# Altium project PCB_Trafficlight.PrjPCB
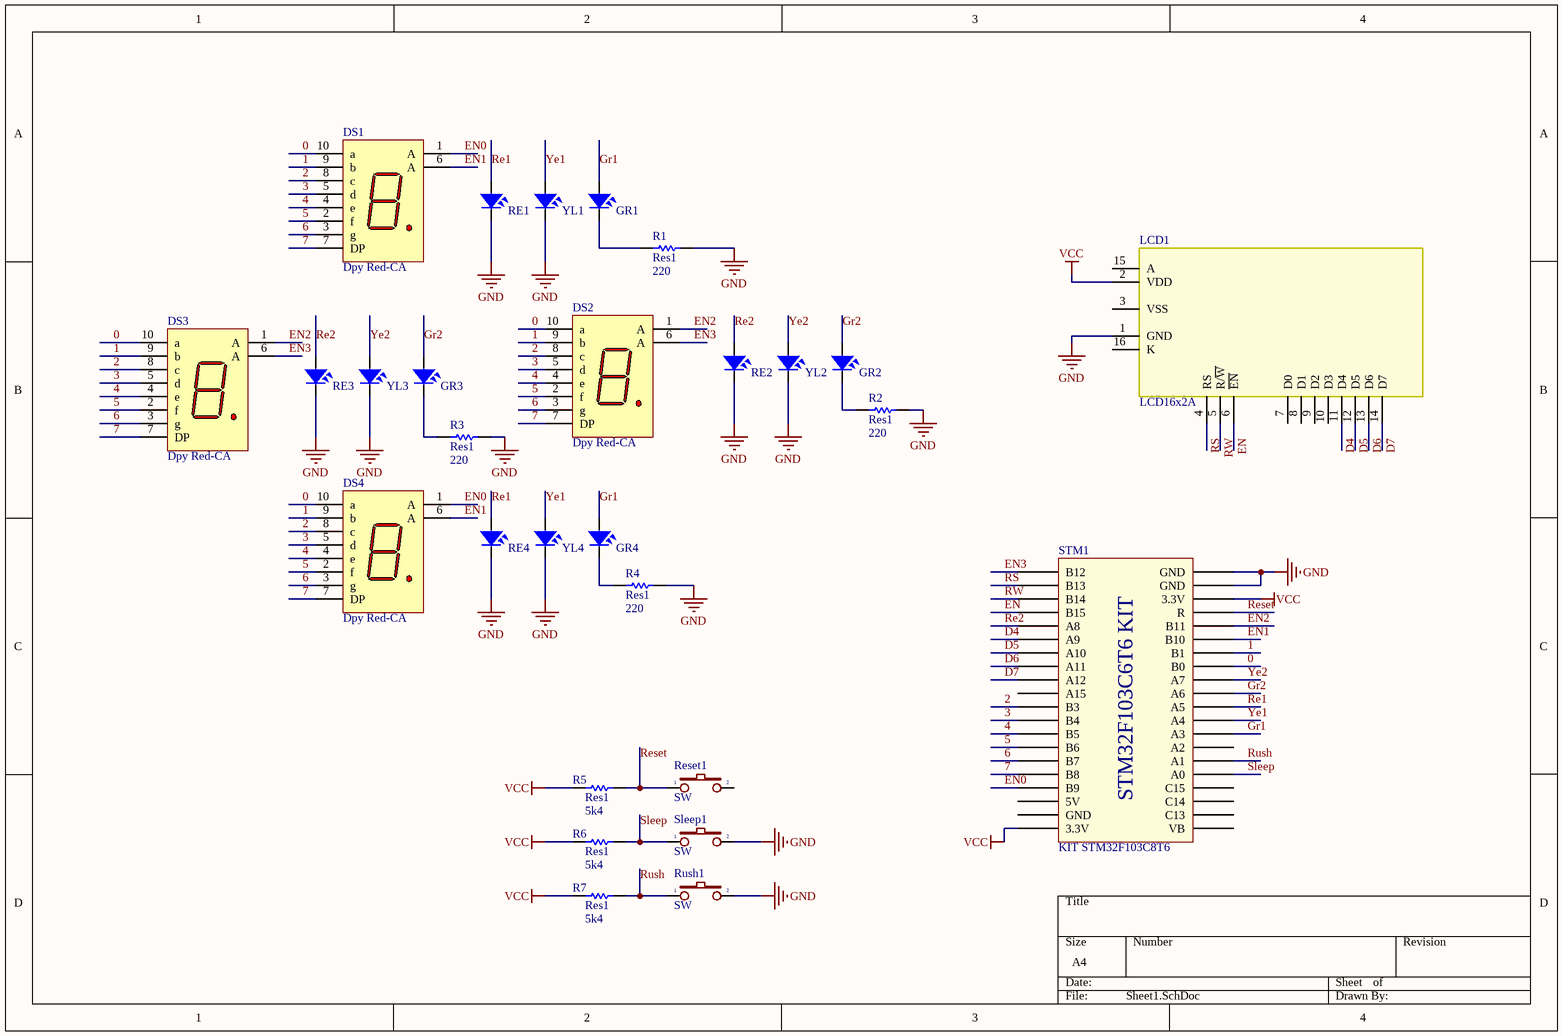
[diagram p0: Sheet1.SchDoc]
1 sheet, 28 parts. Net scope: global (net labels, ports and power ports of the same name join across sheets).
Board file: PCB1.PcbDoc

## Sheet Sheet1.SchDoc
size A4

### Parts
DS1  Dpy Red-CA  [LEDDIP-10]
DS2  Dpy Red-CA  [LEDDIP-10]
DS3  Dpy Red-CA  [LEDDIP-10]
DS4  Dpy Red-CA  [LEDDIP-10]
GR1  LED  [LED-3]  (value not drawn)
GR2  LED  [LED-3]  (value not drawn)
GR3  LED  [LED-3]  (value not drawn)
GR4  LED  [LED-3]  (value not drawn)
LCD1  LCD16x2A  [LCD16X2]
R1  Res1  value 220  [AXIAL-0.3]
R2  Res1  value 220  [AXIAL-0.3]
R3  Res1  value 220  [AXIAL-0.3]
R4  Res1  value 220  [AXIAL-0.3]
R5  Res1  value 5k4  [AXIAL-0.3]
R6  Res1  value 5k4  [AXIAL-0.3]
R7  Res1  value 5k4  [AXIAL-0.3]
RE1  LED  [LED-3]  (value not drawn)
RE2  LED  [LED-3]  (value not drawn)
RE3  LED  [LED-3]  (value not drawn)
RE4  LED  [LED-3]  (value not drawn)
Reset1  SW  [SW2]
Rush1  SW  [SW2]
Sleep1  SW  [SW2]
STM1  KIT STM32F103C8T6  [STM32F103 KIT]
YL1  LED  [LED-3]  (value not drawn)
YL2  LED  [LED-3]  (value not drawn)
YL3  LED  [LED-3]  (value not drawn)
YL4  LED  [LED-3]  (value not drawn)

### Nets
GND: LCD1.1(GND) R1.2 R2.2 R3.2 R4.2 RE1.2 RE2.2 RE3.2 RE4.2 Rush1.2 Sleep1.2 STM1.39(GND) STM1.40(GND) YL1.2 YL2.2 YL3.2 YL4.2
VCC: LCD1.2(VDD) R5.1 R6.1 R7.1 STM1.20(3.3V) STM1.38(3.3V)
0: DS1.10(a) DS2.10(a) DS3.10(a) DS4.10(a) STM1.33(B0)
1: DS1.9(b) DS2.9(b) DS3.9(b) DS4.9(b) STM1.34(B1)
2: DS1.8(c) DS2.8(c) DS3.8(c) DS4.8(c) STM1.11(B3)
3: DS1.5(d) DS2.5(d) DS4.5(d) STM1.12(B4)
~{3}: DS3.5(d)
4: DS1.4(e) DS2.4(e) DS3.4(e) DS4.4(e) STM1.13(B5)
5: DS1.2(f) DS2.2(f) DS3.2(f) DS4.2(f) STM1.14(B6)
6: DS1.3(g) DS2.3(g) DS3.3(g) DS4.3(g) STM1.15(B7)
7: DS1.7(DP) DS2.7(DP) DS3.7(DP) DS4.7(DP) STM1.16(B8)
D4: LCD1.11(D4) STM1.6(A9)
D5: LCD1.12(D5) STM1.7(A10)
D6: LCD1.13(D6) STM1.8(A11)
D7: LCD1.14(D7) STM1.9(A12)
EN: LCD1.6(~{EN}) STM1.4(B15)
EN0: DS1.1(A) DS4.1(A) STM1.17(B9)
EN1: DS1.6(A) DS4.6(A) STM1.35(B10)
EN2: DS2.1(A) DS3.1(A) STM1.36(B11)
EN3: DS2.6(A) DS3.6(A) STM1.1(B12)
Gr1: GR1.1 GR4.1 STM1.28(A3)
Gr2: GR2.1 GR3.1 STM1.31(A6)
Re1: RE1.1 RE4.1 STM1.30(A5)
Re2: RE2.1 RE3.1 STM1.5(A8)
Reset: R5.2 Reset1.1 STM1.37(R)
RS: LCD1.4(RS) STM1.2(B13)
Rush: R7.2 Rush1.1 STM1.26(A1)
RW: LCD1.5(R/~{W}) STM1.3(B14)
Sleep: R6.2 Sleep1.1 STM1.25(A0)
Ye1: STM1.29(A4) YL1.1 YL4.1
Ye2: STM1.32(A7) YL2.1 YL3.1
NetGR1_2: GR1.2 R1.1
NetGR2_2: GR2.2 R2.1
NetGR3_2: GR3.2 R3.1
NetGR4_2: GR4.2 R4.1

Not connected (* = marked no-connect by the designer): LCD1 3(VSS) 7(D0) 8(D1) 9(D2) 10(D3) 15(A) 16(K); Reset1 2; STM1 10(A15) 18(5V) 19(GND) 21(VB) 22(C13) 23(C14) 24(C15) 27(A2)

### Notes on the sheet
- (in symbol STM32f103 Bluepill) STM32F103C6T6 KIT

### Library data of the parts
DS1-DS4 = Dpy Red-CA: 7.62 mm Black Surface HER 7-Segment Display: CA, RH DP; MinimumIntensity: 360 ucd; Note: IF = 5 mA; Colour: High Efficiency Red (HER); Note: Pins 1 and 6 are redundant Anodes.; Published: 8-Jun-2000; LatestRevisionDate: 17-Dec-2003; LatestRevisionNote: Schematic revised, PCB Footprint replaced.; DatasheetDocument: 19-Feb-2002; PackageDocument: 19-Feb-2002; PackageReference: LEDDIP-10; Publisher: Altium Limited; ComponentLink1Description: Manufacturer Link; ComponentLink1URL: http://www.agilent.com/
GR1-GR4 RE1-RE4 YL1-YL4 = LED: LED Single colour Green and Red; Value: LED 3 ly Single Colour
LCD1 = LCD16x2: LCD dipslay 16 char, 2 line; Value: LCD16x2A
R1-R7 = Res1: Resistor; Published: 8-Jun-2000; LatestRevisionDate: 17-Jul-2002; LatestRevisionNote: Re-released for DXP Platform.; PackageReference: AXIAL-0.3; Publisher: Altium Limited
Reset1 Rush1 Sleep1 = SW2: Switch button 2 pin; Value: SW chip 2 pin
STM1 = STM32f103 Bluepill: KIT STM32F103C8T6 Bluepill